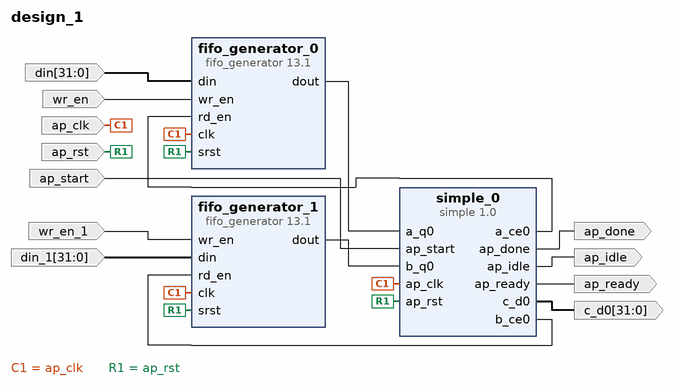
[diagram p0: block diagram of the top level]
# Vivado block design design_1, xc7a35tcpg236-2, Vivado 2017.2
create_bd_design design_1

create_bd_port -dir I -from 31 -to 0 -type data din
create_bd_port -dir I wr_en
create_bd_port -dir I wr_en_1
create_bd_port -dir I -from 31 -to 0 -type data din_1
create_bd_port -dir I -type clk ap_clk
set_property -dict {CONFIG.FREQ_HZ 100000000} [get_bd_ports ap_clk]
create_bd_port -dir I -type rst ap_rst
set_property -dict {CONFIG.POLARITY ACTIVE_HIGH} [get_bd_ports ap_rst]
create_bd_port -dir O ap_ready
create_bd_port -dir O ap_idle
create_bd_port -dir O ap_done
create_bd_port -dir I ap_start
create_bd_port -dir O -from 31 -to 0 -type data c_d0

create_bd_cell -type ip -vlnv xilinx.com:hls:simple:1.0 simple_0
create_bd_cell -type ip -vlnv xilinx.com:ip:fifo_generator:13.1 fifo_generator_0
set_property -dict {CONFIG.Input_Data_Width 32 CONFIG.Output_Data_Width 32} [get_bd_cells fifo_generator_0]
create_bd_cell -type ip -vlnv xilinx.com:ip:fifo_generator:13.1 fifo_generator_1
set_property -dict {CONFIG.Input_Data_Width 32 CONFIG.Output_Data_Width 32} [get_bd_cells fifo_generator_1]

# ---- connections ----

connect_bd_net [get_bd_ports din] [get_bd_pins fifo_generator_0/din]
connect_bd_net [get_bd_ports wr_en] [get_bd_pins fifo_generator_0/wr_en]
connect_bd_net [get_bd_pins fifo_generator_0/dout] [get_bd_pins simple_0/a_q0]
connect_bd_net [get_bd_pins simple_0/a_ce0] [get_bd_pins fifo_generator_0/rd_en]
connect_bd_net [get_bd_ports ap_clk] [get_bd_pins fifo_generator_0/clk] [get_bd_pins fifo_generator_1/clk] [get_bd_pins simple_0/ap_clk]
connect_bd_net [get_bd_ports ap_rst] [get_bd_pins fifo_generator_0/srst] [get_bd_pins fifo_generator_1/srst] [get_bd_pins simple_0/ap_rst]
connect_bd_net [get_bd_pins simple_0/b_ce0] [get_bd_pins fifo_generator_1/rd_en]
connect_bd_net [get_bd_pins fifo_generator_1/dout] [get_bd_pins simple_0/b_q0]
connect_bd_net -net wr_en_1_1 [get_bd_ports wr_en_1] [get_bd_pins fifo_generator_1/wr_en]
connect_bd_net -net din_1_1 [get_bd_ports din_1] [get_bd_pins fifo_generator_1/din]
connect_bd_net [get_bd_pins simple_0/ap_ready] [get_bd_ports ap_ready]
connect_bd_net [get_bd_pins simple_0/ap_idle] [get_bd_ports ap_idle]
connect_bd_net [get_bd_pins simple_0/ap_done] [get_bd_ports ap_done]
connect_bd_net [get_bd_ports ap_start] [get_bd_pins simple_0/ap_start]
connect_bd_net [get_bd_pins simple_0/c_d0] [get_bd_ports c_d0]

validate_bd_design
save_bd_design
